# Altium schematic sheet 原理图.SchDoc
size A3
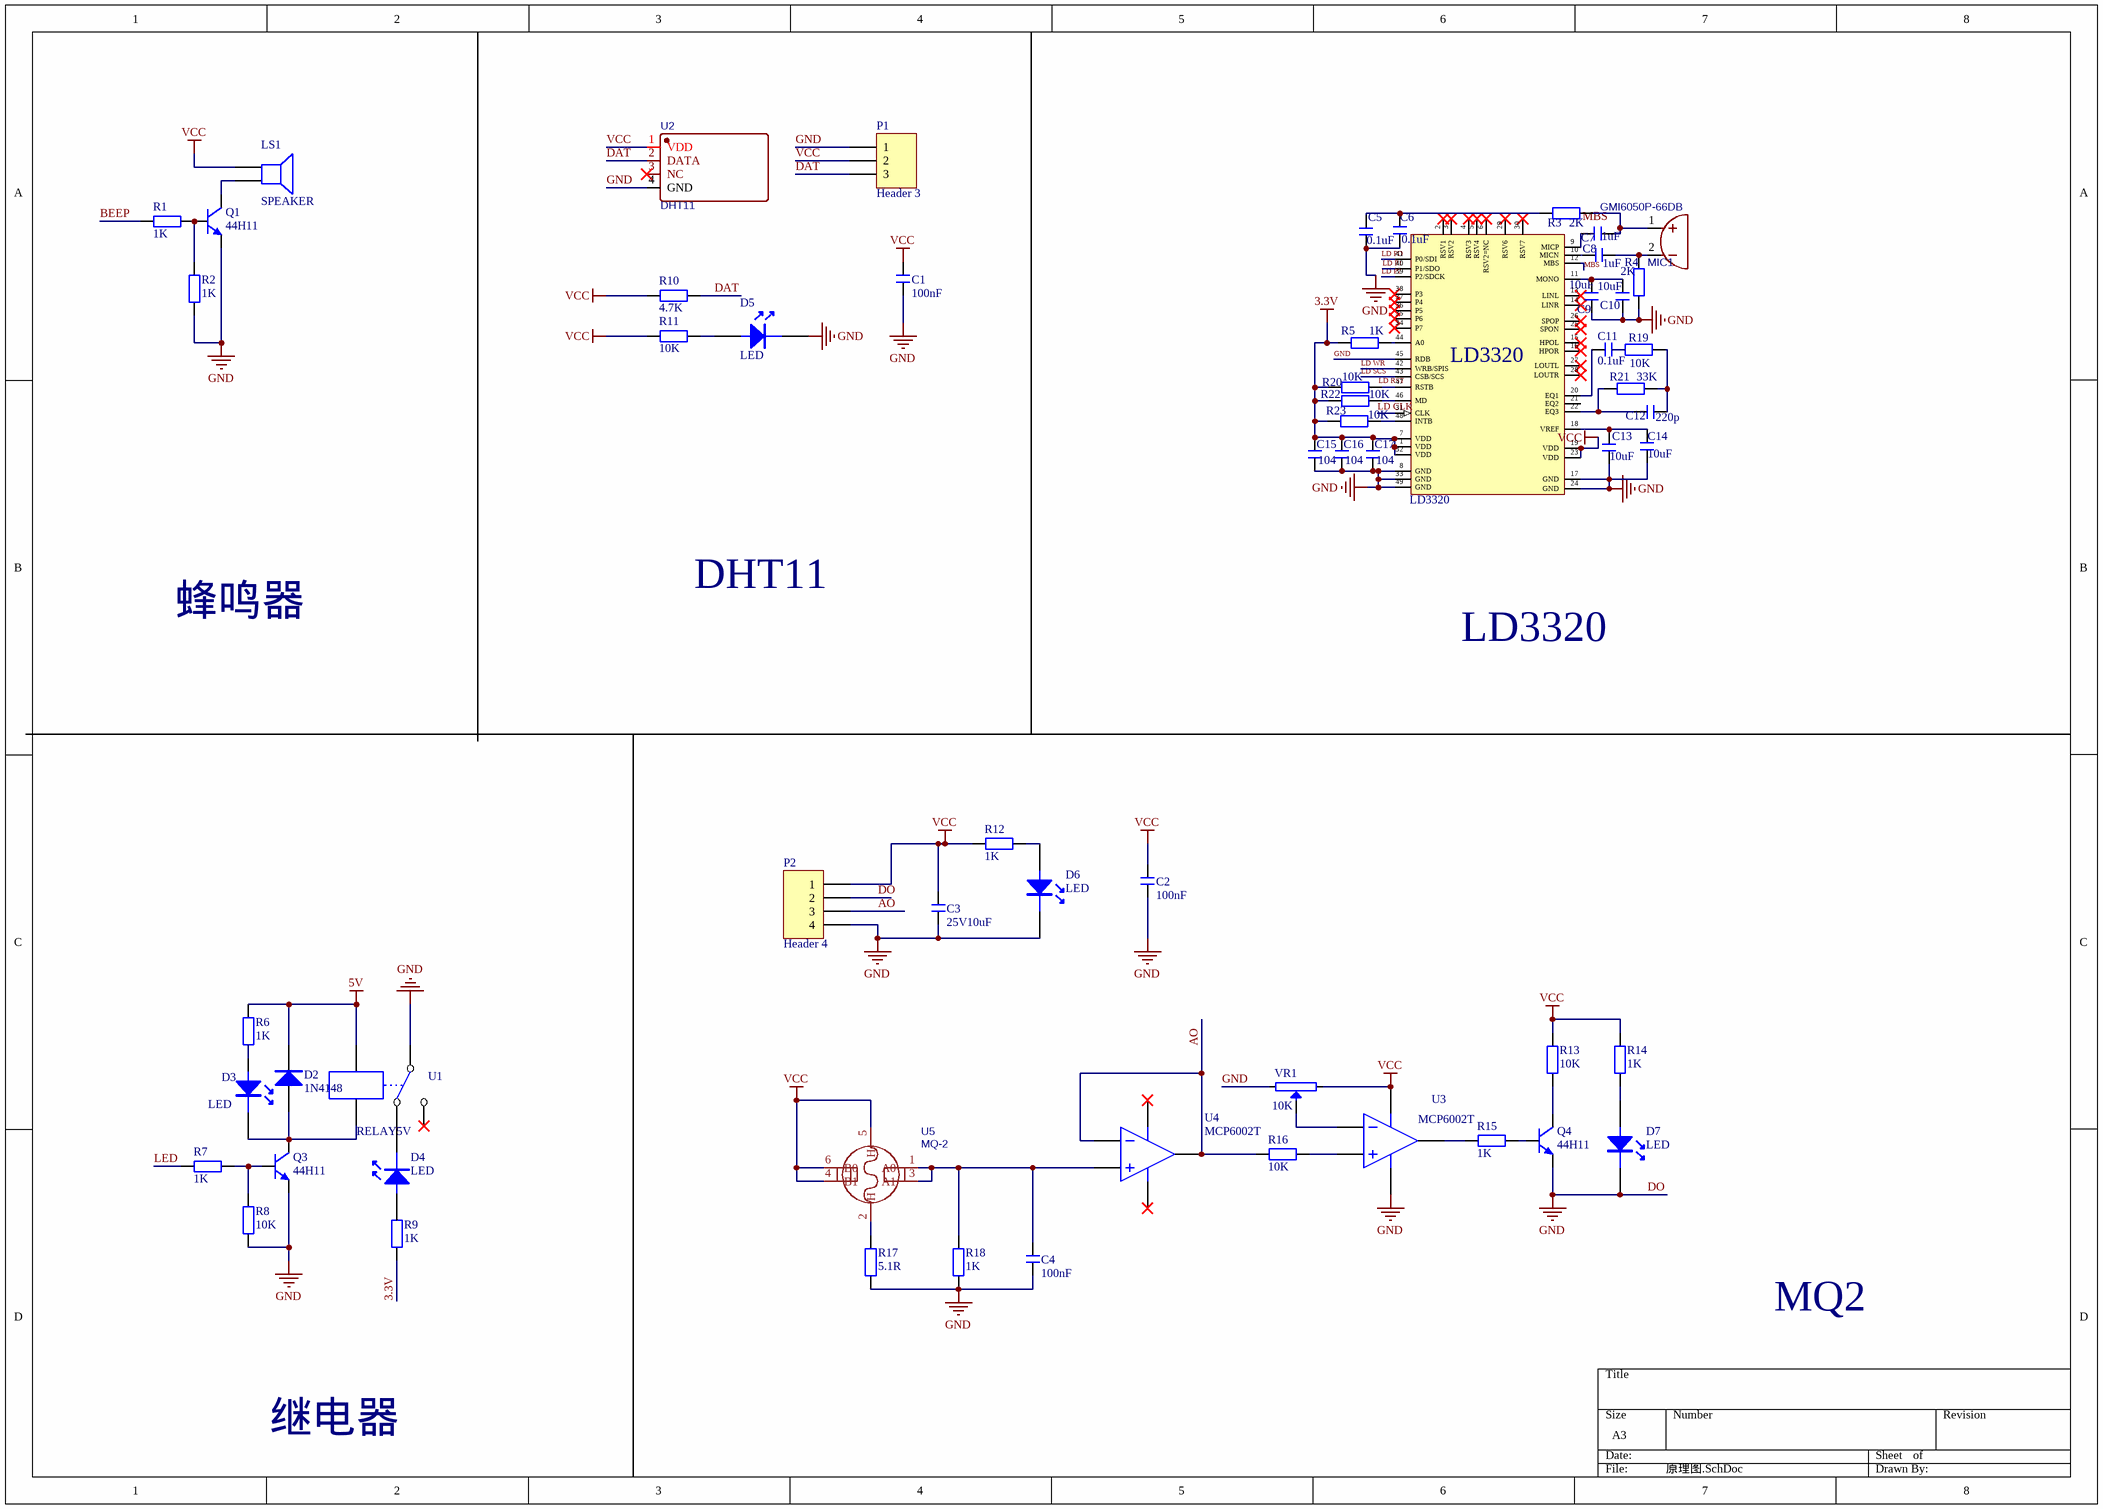
[diagram p0: 原理图.SchDoc]

## Parts
?  LD3320  (part B of 2)
C1  100nF  [C 0805_L]
C2  100nF  [C 0805_L]
C3  25V10uF  [C 0805_L]
C4  100nF  [C 0805_L]
C5  0.1uF  [C 0805_L]
C6  0.1uF  [C 0805_L]
C7  1uF  [C 0805_L]
C8  1uF  [C 0805_L]
C9  10uF  [C 0805_L]
C10  10uF  [C 0805_L]
C11  0.1uF  [C 0805_L]
C12  220p  [C 0805_L]
C13  10uF  [C 0805_L]
C14  10uF  [C 0805_L]
C15  104  [C 0805_L]
C16  104  [C 0805_L]
C17  104  [C 0805_L]
D2  1N4148  [DIODE0.4A]
D3  LED  [DIODE0.4A]
D4  LED  [DIODE0.4A]
D5  LED  [DIODE0.4A]
D6  LED  [DIODE0.4A]
D7  LED  [DIODE0.4A]
LS1  SPEAKER
MIC1  GMI6050P-66DB  [MIC-TH_BD6.0-P1.90-D0.4-L-RD]
P1  Header 3  [HDR1X3]
P2  Header 4  [HDR1X4]
Q1  44H11  [TO252]
Q3  44H11  [TO252]
Q4  44H11  [TO252]
R1  1K  [R 0805_L]
R2  1K  [R 0805_L]
R3  2K  [R 0805_L]
R4  2K  [R 0805_L]
R5  1K  [R 0805_L]
R6  1K  [R 0805_L]
R7  1K  [R 0805_L]
R8  10K  [R 0805_L]
R9  1K  [R 0805_L]
R10  4.7K  [R 0805_L]
R11  10K  [R 0805_L]
R12  1K  [R 0805_L]
R13  10K  [R 0805_L]
R14  1K  [R 0805_L]
R15  1K  [R 0805_L]
R16  10K  [R 0805_L]
R17  5.1R  [R 0805_L]
R18  1K  [R 0805_L]
R19  10K  [R 0805_L]
R20  10K  [R 0805_L]
R21  33K  [R 0805_L]
R22  10K  [R 0805_L]
R23  10K  [R 0805_L]
U1  RELAY5V  [Relay5V]
U2  DHT11  [SENSOR-TH_DHT11]
U3  MCP6002T
U4  MCP6002T
U5  MQ-2  [SENSOR-TH_MQ-2]
VR1  10K  [VR3296]

## Nets
3.3V: ?.1(VDD) ?.7(VDD) ?.32(VDD) C15.2 C16.2 C17.2 R5.1 R9.1 R20.1 R22.1 R23.1
5V: D2.K R6.2 U1.4
DO: ?.8(GND) ?.17(GND) ?.24(GND) ?.33(GND) ?.45(RDB) ?.49(GND) C1.1 C2.1 C3.1 C4.1 C5.1 C6.1 C9.1 C10.1 C13.2 C14.1 C15.1 C16.1 C17.1 D5.K D6.K D7.K P1.1 P2.2 P2.4 Q1.3(E) Q3.3(E) Q4.3(E) R2.1 R4.1 R8.1 R17.1 R18.1 U1.1 U2.4(GND) U3.5(V-) VR1.1  [also labelled GND]
VCC: ?.19(VDD) ?.23(VDD) C1.2 C2.2 C3.2 LS1.1 P1.2 P2.1 R10.1 R11.1 R12.1 R13.2 R14.2 U2.1(VDD) U3.4(V+) U5.4(B1) U5.5(H) U5.6(B0) VR1.2
AO: P2.3 R16.1 U4.1(IN-) U4.3(OUT)
BEEP: R1.1
DAT: P1.3 R10.2 U2.2(DATA)
LD CLK: ?.31(CLK)
LD P1: ?.40(P1/SDO)
LD P2: ?.39(P2/SDCK)
LD PO: ?.41(P0/SDI)
LD SCS: ?.43(CSB/SCS)
LD WR: ?.42(WRB/SPIS)
LED: R7.1
MBS: ?.12(MBS)
Net?_9: ?.9(MICP) C7.1
Net?_10: ?.10(MICN) C8.1
Net?_11: ?.11(MONO) C9.2 C10.2
Net?_18: ?.18(VREF) C13.1 C14.2
Net?_20: ?.20(EQ1) C11.1
Net?_22: ?.22(EQ3) C12.1 R21.1
Net?_44: ?.44(A0) R5.2
Net?_46: ?.46(MD) R22.2
Net?_47: ?.47(RSTB) R20.2
Net?_48: ?.48(INTB) R23.2
NetC4_2: C4.2 R18.2 U4.2(IN+) U5.1(A0) U5.3(A1)
NetC5_2: C5.2 C6.2 R3.2
NetC7_2: C7.2 MIC1.1 R3.1
NetC8_2: C8.2 MIC1.2 R4.2
NetC11_2: C11.2 R19.1
NetC12_2: C12.2 R19.2 R21.2
NetD2_A: D2.A D3.K Q3.2(C) U1.5
NetD3_A: D3.A R6.1
NetD4_K: D4.K U1.3
NetD5_A: D5.A R11.2
NetD6_A: D6.A R12.2
NetD7_A: D7.A R14.1
NetLS1_2: LS1.2 Q1.2(C)
NetQ1_1: Q1.1(B) R1.2 R2.2
NetQ3_1: Q3.1(B) R7.2 R8.2
NetQ4_1: Q4.1(B) R15.2
NetQ4_2: Q4.2(C) R13.1
NetR15_1: R15.1 U3.3(OUT)
NetR16_2: R16.2 U3.2(IN+)
NetR17_2: R17.2 U5.2(H)
NetU3_1: U3.1(IN-) VR1.W

Not connected (* = marked no-connect by the designer): ? 2(RSV1)* 3(RSV2)* 4(RSV3)* 5(RSV4)* 6(RSV2=NC)* 13(LINL)* 14(LINR)* 15(HPOL)* 16(HPOR)* 21(EQ2) 25(SPON)* 26(SPOP)* 27(LOUTL)* 28(LOUTR)* 29(RSV6)* 30(RSV7)* 34(P7)* 35(P6)* 36(P5)* 37(P4)* 38(P3)*; D4 A(1); R9 2; U1 2*; U2 3(NC)*; U4 4(V+)* 5(V-)*

## Notes on the sheet
- 蜂鸣器
- DHT11
- LD3320
- MQ2
- 继电器
- Labels drawn without touching a wire or pin: LD RST, MBS

## Library data of the parts
? = LD3320: 语音
C1-C17 = C: 无极性贴片电容; 版权归属: 源创客; BOM名称: 无极性贴片电容; 学习资源: www.ooocke.com
D2 = DIODE
D3-D7 = 发光二极管
MIC1 = GMI6050P-66DB: BOM_Manufacturer: INGHAi; Contributor: LCSC; BOM_Paste Type: expand; BOM_Supplier: LCSC; BOM_Supplier Part: C233954; BOM_Manufacturer Part: GMI6050P-66DB; spicePre: M; spiceSymbolName: GMI6050P-66DB
P1 = Header 3: Header, 3-Pin; LatestRevisionDate: 17-Jul-2002; LatestRevisionNote: Re-released for DXP Platform.; Publisher: Altium Limited
P2 = Header 4: Header, 4-Pin; LatestRevisionDate: 17-Jul-2002; LatestRevisionNote: Re-released for DXP Platform.; Publisher: Altium Limited
Q1 Q3 Q4 = 44H11: 互补功率-NPN型; 版权归属: 源创客; 属性: 80V 8A 50W; BOM名称: 互补功率-NPN型; 学习资源: www.ooocke.com
R1-R23 = R: 贴片电阻; 版权归属: 源创客; BOM名称: 贴片电阻; 学习资源: www.ooocke.com
U2 = DHT11: BOM_Manufacturer: Aosong (Guangzhou) Elec; Contributor: LCSC; BOM_Paste Type: expand; BOM_Supplier: LCSC; BOM_Supplier Part: C117051; BOM_Manufacturer Part: DHT11; spicePre: U; spiceSymbolName: DHT11
U3 U4 = OPAMP: Operational Amplifier
U5 = MQ-2: BOM_Manufacturer: Winsen; BOM_Paste Type: expand; BOM_Supplier: LCSC; BOM_Manufacturer Part: MQ-2; BOM_Supplier Part: C99296; spicePre: U; spiceSymbolName: MQ-2
VR1 = VR